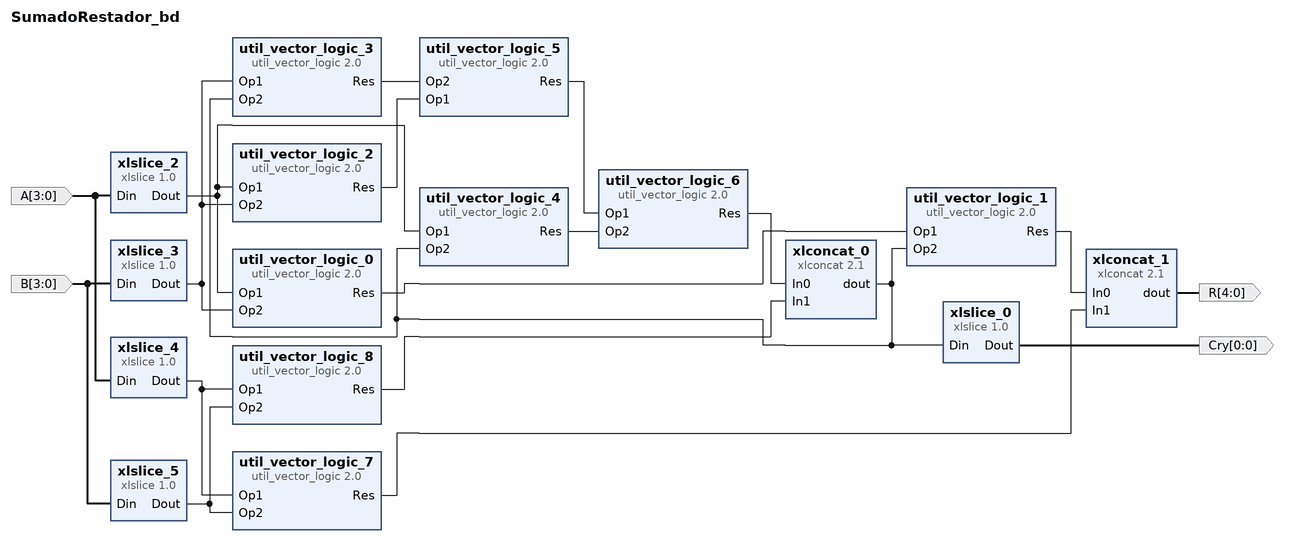
[diagram p0: block diagram of the top level]
# Vivado block design SumadoRestador_bd, xc7a35ticpg236-1L, Vivado 2023.2
create_bd_design SumadoRestador_bd

create_bd_port -dir I -from 3 -to 0 A
create_bd_port -dir O -from 4 -to 0 R
create_bd_port -dir O -from 0 -to 0 Cry
create_bd_port -dir I -from 3 -to 0 B

create_bd_cell -type ip -vlnv xilinx.com:ip:util_vector_logic:2.0 util_vector_logic_0
set_property -dict {CONFIG.C_OPERATION xor CONFIG.C_SIZE 3} [get_bd_cells util_vector_logic_0]
create_bd_cell -type ip -vlnv xilinx.com:ip:util_vector_logic:2.0 util_vector_logic_1
set_property -dict {CONFIG.C_OPERATION xor CONFIG.C_SIZE 4} [get_bd_cells util_vector_logic_1]
create_bd_cell -type ip -vlnv xilinx.com:ip:util_vector_logic:2.0 util_vector_logic_2
set_property -dict {CONFIG.C_SIZE 3} [get_bd_cells util_vector_logic_2]
create_bd_cell -type ip -vlnv xilinx.com:ip:util_vector_logic:2.0 util_vector_logic_3
set_property -dict {CONFIG.C_SIZE 4} [get_bd_cells util_vector_logic_3]
create_bd_cell -type ip -vlnv xilinx.com:ip:util_vector_logic:2.0 util_vector_logic_4
set_property -dict {CONFIG.C_SIZE 4} [get_bd_cells util_vector_logic_4]
create_bd_cell -type ip -vlnv xilinx.com:ip:util_vector_logic:2.0 util_vector_logic_5
set_property -dict {CONFIG.C_OPERATION or CONFIG.C_SIZE 3} [get_bd_cells util_vector_logic_5]
create_bd_cell -type ip -vlnv xilinx.com:ip:util_vector_logic:2.0 util_vector_logic_6
set_property -dict {CONFIG.C_OPERATION or CONFIG.C_SIZE 3} [get_bd_cells util_vector_logic_6]
create_bd_cell -type ip -vlnv xilinx.com:ip:xlslice:1.0 xlslice_0
set_property -dict {CONFIG.DIN_FROM 3 CONFIG.DIN_TO 3 CONFIG.DIN_WIDTH 4} [get_bd_cells xlslice_0]
create_bd_cell -type ip -vlnv xilinx.com:ip:xlslice:1.0 xlslice_2
set_property -dict {CONFIG.DIN_FROM 3 CONFIG.DIN_TO 1 CONFIG.DIN_WIDTH 4} [get_bd_cells xlslice_2]
create_bd_cell -type ip -vlnv xilinx.com:ip:xlslice:1.0 xlslice_3
set_property -dict {CONFIG.DIN_FROM 3 CONFIG.DIN_TO 1 CONFIG.DIN_WIDTH 4} [get_bd_cells xlslice_3]
create_bd_cell -type ip -vlnv xilinx.com:ip:xlslice:1.0 xlslice_4
set_property -dict {CONFIG.DIN_WIDTH 4} [get_bd_cells xlslice_4]
create_bd_cell -type ip -vlnv xilinx.com:ip:xlslice:1.0 xlslice_5
set_property -dict {CONFIG.DIN_WIDTH 4} [get_bd_cells xlslice_5]
create_bd_cell -type ip -vlnv xilinx.com:ip:util_vector_logic:2.0 util_vector_logic_7
set_property -dict {CONFIG.C_OPERATION xor CONFIG.C_SIZE 1} [get_bd_cells util_vector_logic_7]
create_bd_cell -type ip -vlnv xilinx.com:ip:util_vector_logic:2.0 util_vector_logic_8
set_property -dict {CONFIG.C_SIZE 1} [get_bd_cells util_vector_logic_8]
create_bd_cell -type ip -vlnv xilinx.com:ip:xlconcat:2.1 xlconcat_0
set_property -dict {CONFIG.IN0_WIDTH 3 CONFIG.IN1_WIDTH 1} [get_bd_cells xlconcat_0]
create_bd_cell -type ip -vlnv xilinx.com:ip:xlconcat:2.1 xlconcat_1
set_property -dict {CONFIG.IN0_WIDTH 3 CONFIG.IN1_WIDTH 1} [get_bd_cells xlconcat_1]

# ---- connections ----

connect_bd_net [get_bd_ports A] [get_bd_pins xlslice_2/Din] [get_bd_pins xlslice_4/Din]
connect_bd_net -net B1_1 [get_bd_ports B] [get_bd_pins xlslice_3/Din] [get_bd_pins xlslice_5/Din]
connect_bd_net -net B_1 [get_bd_pins xlslice_3/Dout] \
  [get_bd_pins util_vector_logic_2/Op2] [get_bd_pins util_vector_logic_3/Op1] [get_bd_pins util_vector_logic_0/Op2]
connect_bd_net [get_bd_pins util_vector_logic_0/Res] [get_bd_pins util_vector_logic_1/Op1]
connect_bd_net [get_bd_pins util_vector_logic_1/Res] [get_bd_pins xlconcat_1/In0]
connect_bd_net [get_bd_pins util_vector_logic_2/Res] [get_bd_pins util_vector_logic_5/Op1]
connect_bd_net [get_bd_pins util_vector_logic_3/Res] [get_bd_pins util_vector_logic_5/Op2]
connect_bd_net [get_bd_pins util_vector_logic_4/Res] [get_bd_pins util_vector_logic_6/Op2]
connect_bd_net [get_bd_pins util_vector_logic_5/Res] [get_bd_pins util_vector_logic_6/Op1]
connect_bd_net -net util_vector_logic_6_Res [get_bd_pins xlconcat_0/dout] \
  [get_bd_pins util_vector_logic_3/Op2] [get_bd_pins util_vector_logic_4/Op2] [get_bd_pins util_vector_logic_1/Op2] \
  [get_bd_pins xlslice_0/Din]
connect_bd_net [get_bd_pins util_vector_logic_6/Res] [get_bd_pins xlconcat_0/In0]
connect_bd_net [get_bd_pins util_vector_logic_7/Res] [get_bd_pins xlconcat_1/In1]
connect_bd_net [get_bd_pins util_vector_logic_8/Res] [get_bd_pins xlconcat_0/In1]
connect_bd_net [get_bd_pins xlconcat_1/dout] [get_bd_ports R]
connect_bd_net [get_bd_pins xlslice_0/Dout] [get_bd_ports Cry]
connect_bd_net [get_bd_pins xlslice_2/Dout] \
  [get_bd_pins util_vector_logic_2/Op1] [get_bd_pins util_vector_logic_4/Op1] [get_bd_pins util_vector_logic_0/Op1]
connect_bd_net [get_bd_pins xlslice_4/Dout] [get_bd_pins util_vector_logic_7/Op1] [get_bd_pins util_vector_logic_8/Op1]
connect_bd_net [get_bd_pins xlslice_5/Dout] [get_bd_pins util_vector_logic_7/Op2] [get_bd_pins util_vector_logic_8/Op2]

validate_bd_design
save_bd_design
